# Altium project LTC3260.PrjPCB
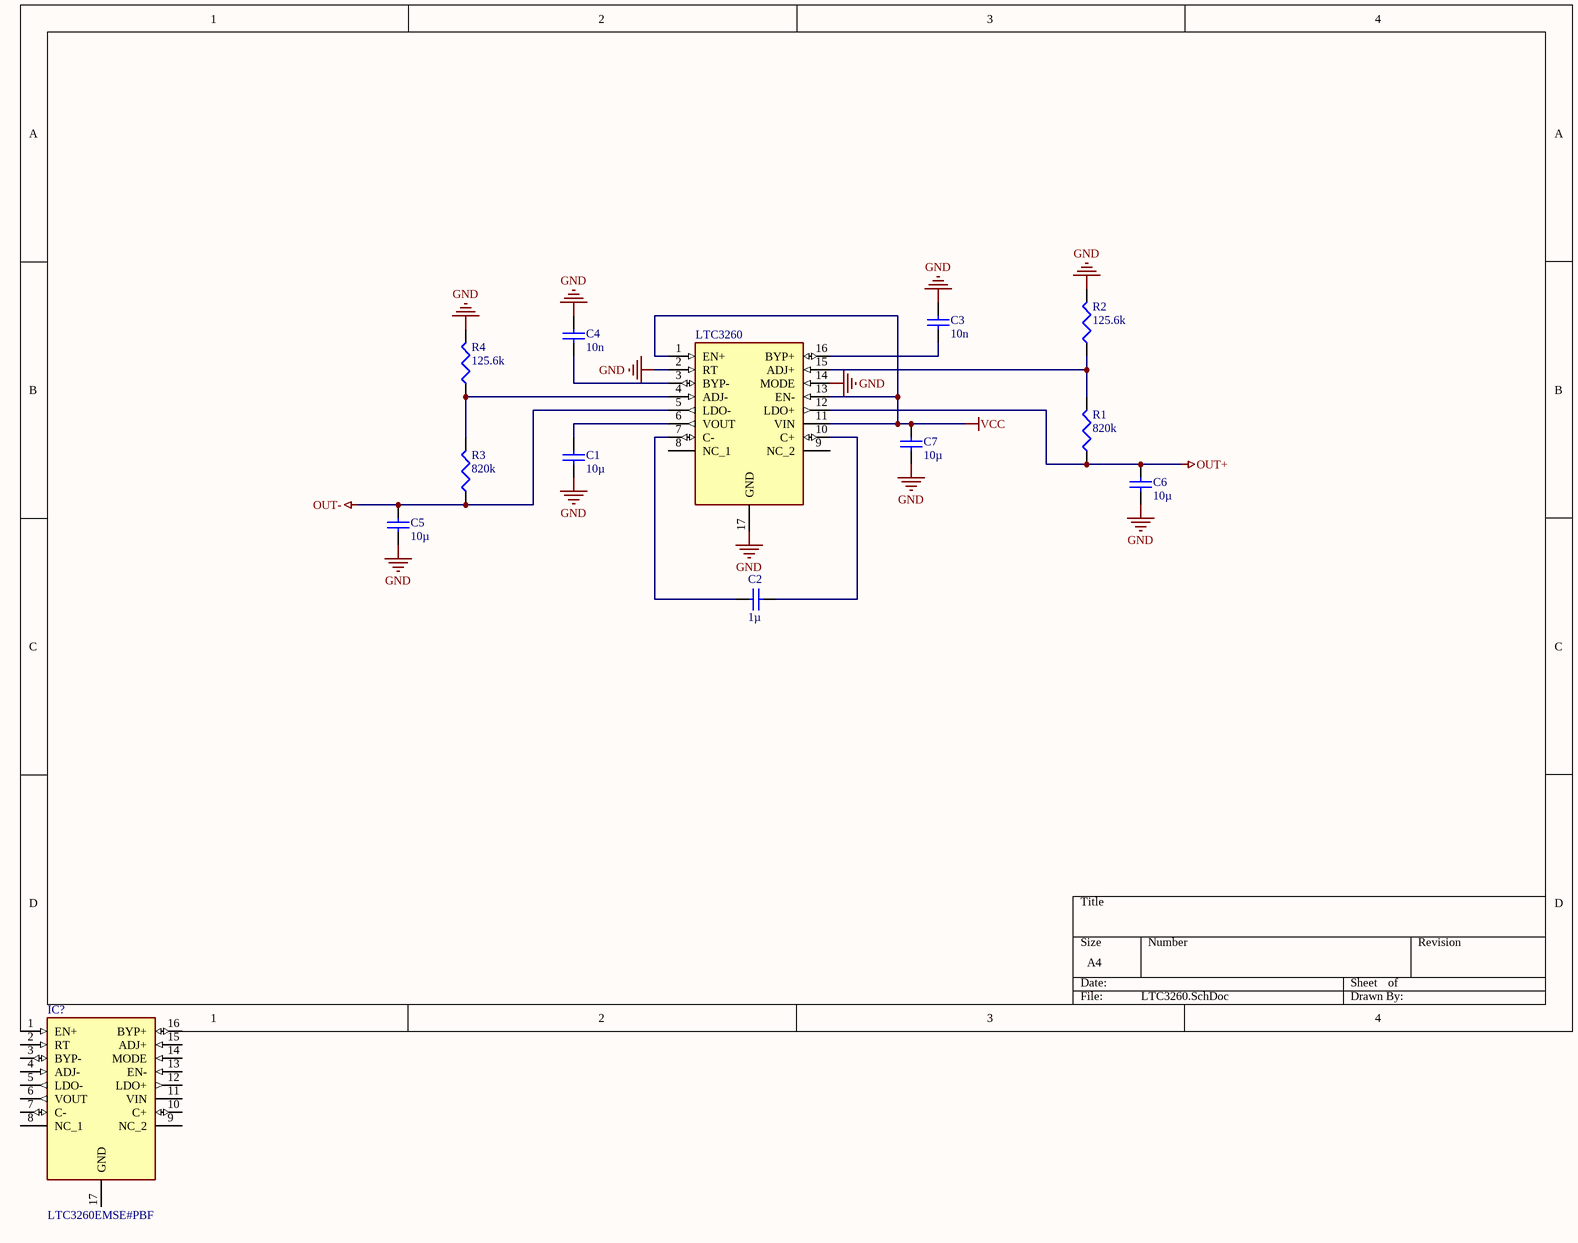
[diagram p0: LTC3260.SchDoc]
1 sheet, 13 parts. Net scope: global (net labels, ports and power ports of the same name join across sheets).

## Sheet LTC3260.SchDoc
size A4

### Parts
C1  value 10µ  [CAPR2.54-5.1x3.2]  (hidden comment: Condensateur)
C2  value 1µ  [CAPR2.54-5.1x3.2]  (hidden comment: Condensateur)
C3  value 10n  [CAPR2.54-5.1x3.2]  (hidden comment: Condensateur)
C4  value 10n  [CAPR2.54-5.1x3.2]  (hidden comment: Condensateur)
C5  value 10µ  [CAPR2.54-5.1x3.2]  (hidden comment: Condensateur)
C6  value 10µ  [CAPR2.54-5.1x3.2]  (hidden comment: Condensateur)
C7  value 10µ  [CAPR2.54-5.1x3.2]  (hidden comment: Condensateur)
IC?  LTC3260EMSE#PBF  [SOP50P490X110-17N]
LTC3260  LTC3260EMSE#PBF  [SOP50P490X110-17N]  (value not drawn)
R1  value 820k  [AXIAL-0.4]  (hidden comment: Résistance)
R2  value 125.6k  [AXIAL-0.4]  (hidden comment: Résistance)
R3  value 820k  [AXIAL-0.4]  (hidden comment: Résistance)
R4  value 125.6k  [AXIAL-0.4]  (hidden comment: Résistance)

### Nets
GND: C1.1 C3.1 C4.1 C5.2 C6.2 C7.2 LTC3260.2(RT) LTC3260.14(MODE) LTC3260.17(GND) R2.2 R4.2
OUT+: C6.1 LTC3260.12(LDO+) R1.1
OUT-: C5.1 LTC3260.5(LDO-) R3.1
VCC: C7.1 LTC3260.1(EN+) LTC3260.11(VIN) LTC3260.13(EN-)
NetC1_2: C1.2 LTC3260.6(VOUT)
NetC2_1: C2.1 LTC3260.7(C-)
NetC2_2: C2.2 LTC3260.10(C+)
NetC3_2: C3.2 LTC3260.16(BYP+)
NetC4_2: C4.2 LTC3260.3(BYP-)
NetLTC3260_4: LTC3260.4(ADJ-) R3.2 R4.1
NetLTC3260_15: LTC3260.15(ADJ+) R1.2 R2.1

Not connected (* = marked no-connect by the designer): IC? 1(EN+) 2(RT) 3(BYP-) 4(ADJ-) 5(LDO-) 6(VOUT) 7(C-) 8(NC_1) 9(NC_2) 10(C+) 11(VIN) 12(LDO+) 13(EN-) 14(MODE) 15(ADJ+) 16(BYP+) 17(GND); LTC3260 8(NC_1) 9(NC_2)

### Library data of the parts
IC? LTC3260 = LTC3260EMSE#PBF: Integrated Circuit; Manufacturer_Name: Linear Technology; Datasheet Link: http://cds.linear.com/docs/en/datasheet/3260fa.pdf; Height: 1.1mm; Manufacturer_Part_Number: LTC3260EMSE#PBF; Mouser Part Number: 584-LTC3260EMSE#PBF; Mouser Price/Stock: https://www.mouser.com/Search/Refine.aspx?Keyword=584-LTC3260EMSE%23PBF; RS Part Number: 8516768P; RS Price/Stock: http://uk.rs-online.com/web/p/products/8516768P
R1-R4 = Résistance: Résistance standard; Designer: ECAM 2005; Type: Résistance standard
C1-C7 = Condensateur: Supplier: Farnell; Designer: ECAM 2004